# EAGLE schematic breadboard (EAGLE 9.7.0)
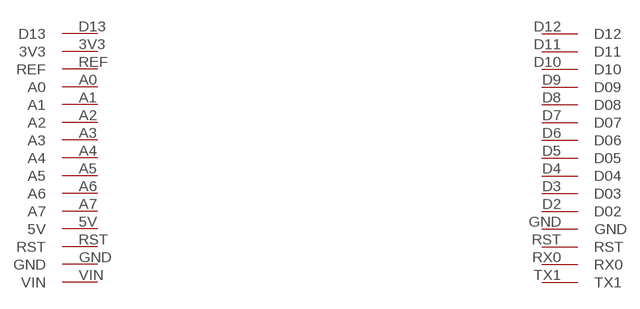
[diagram p0: schematic, sheet 1]

## Parts
U$2  ARDUINO-NANO-JUMPER-1  [ARDUINO-NANO-JUMPER-1]
U$5  ARDUINO-NANO-JUMPER-2  [ARDUINO-NANO-JUMPER-2]
Unconnected: U$2.D2(D02) U$2.D3(D03) U$2.D4(D04) U$2.D5(D05) U$2.D6(D06) U$2.D7(D07) U$2.D8(D08) U$2.D9(D09) U$2.D10 U$2.D11 U$2.D12 U$2.GND U$2.RST U$2.RX0 U$2.TX1 U$5.3V3 U$5.5V U$5.A0 U$5.A1 U$5.A2 U$5.A3 U$5.A4 U$5.A5 U$5.A6 U$5.A7 U$5.D13 U$5.GND U$5.REF U$5.RST U$5.VIN

## Library data of the parts
U$2 = RC Car:ARDUINO-NANO-JUMPER-1
U$5 = RC Car:ARDUINO-NANO-JUMPER-2